# EasyEDA Pro project ProPrj_MSP3507拓展板_2025-07-14_10-12-05_2025-07-20.epro, board PCB1
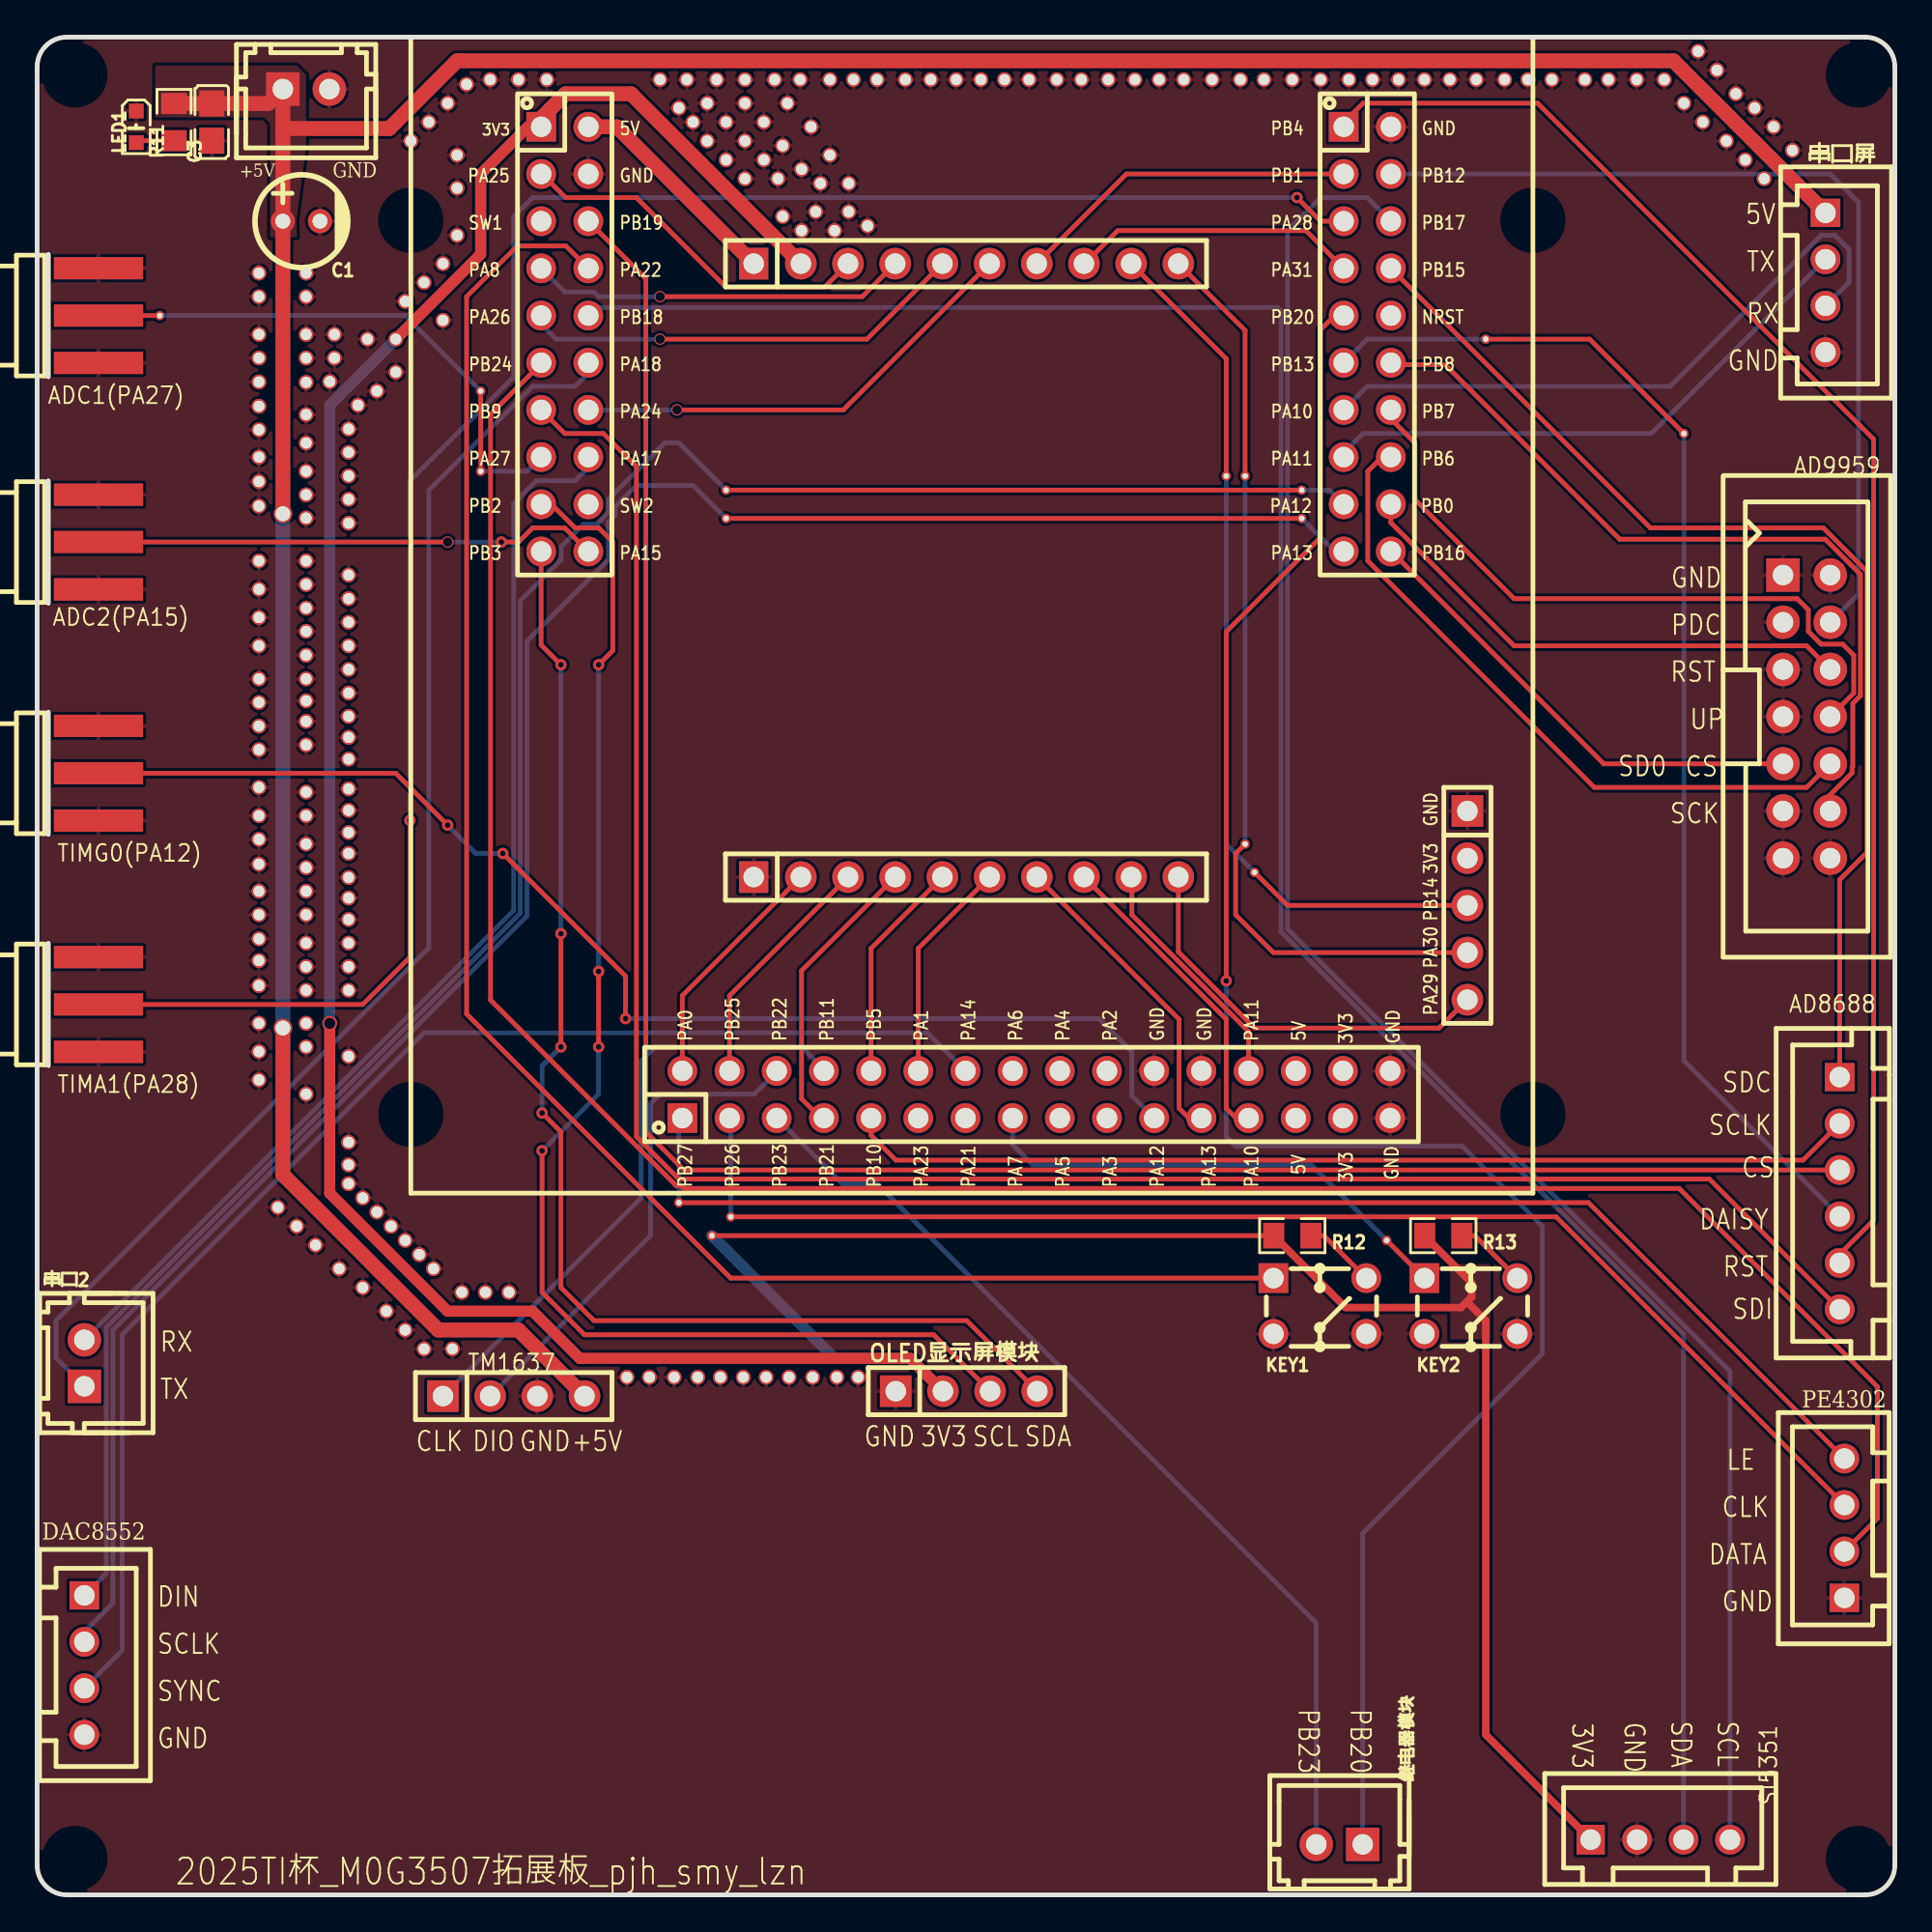
[diagram p1: board, top side]
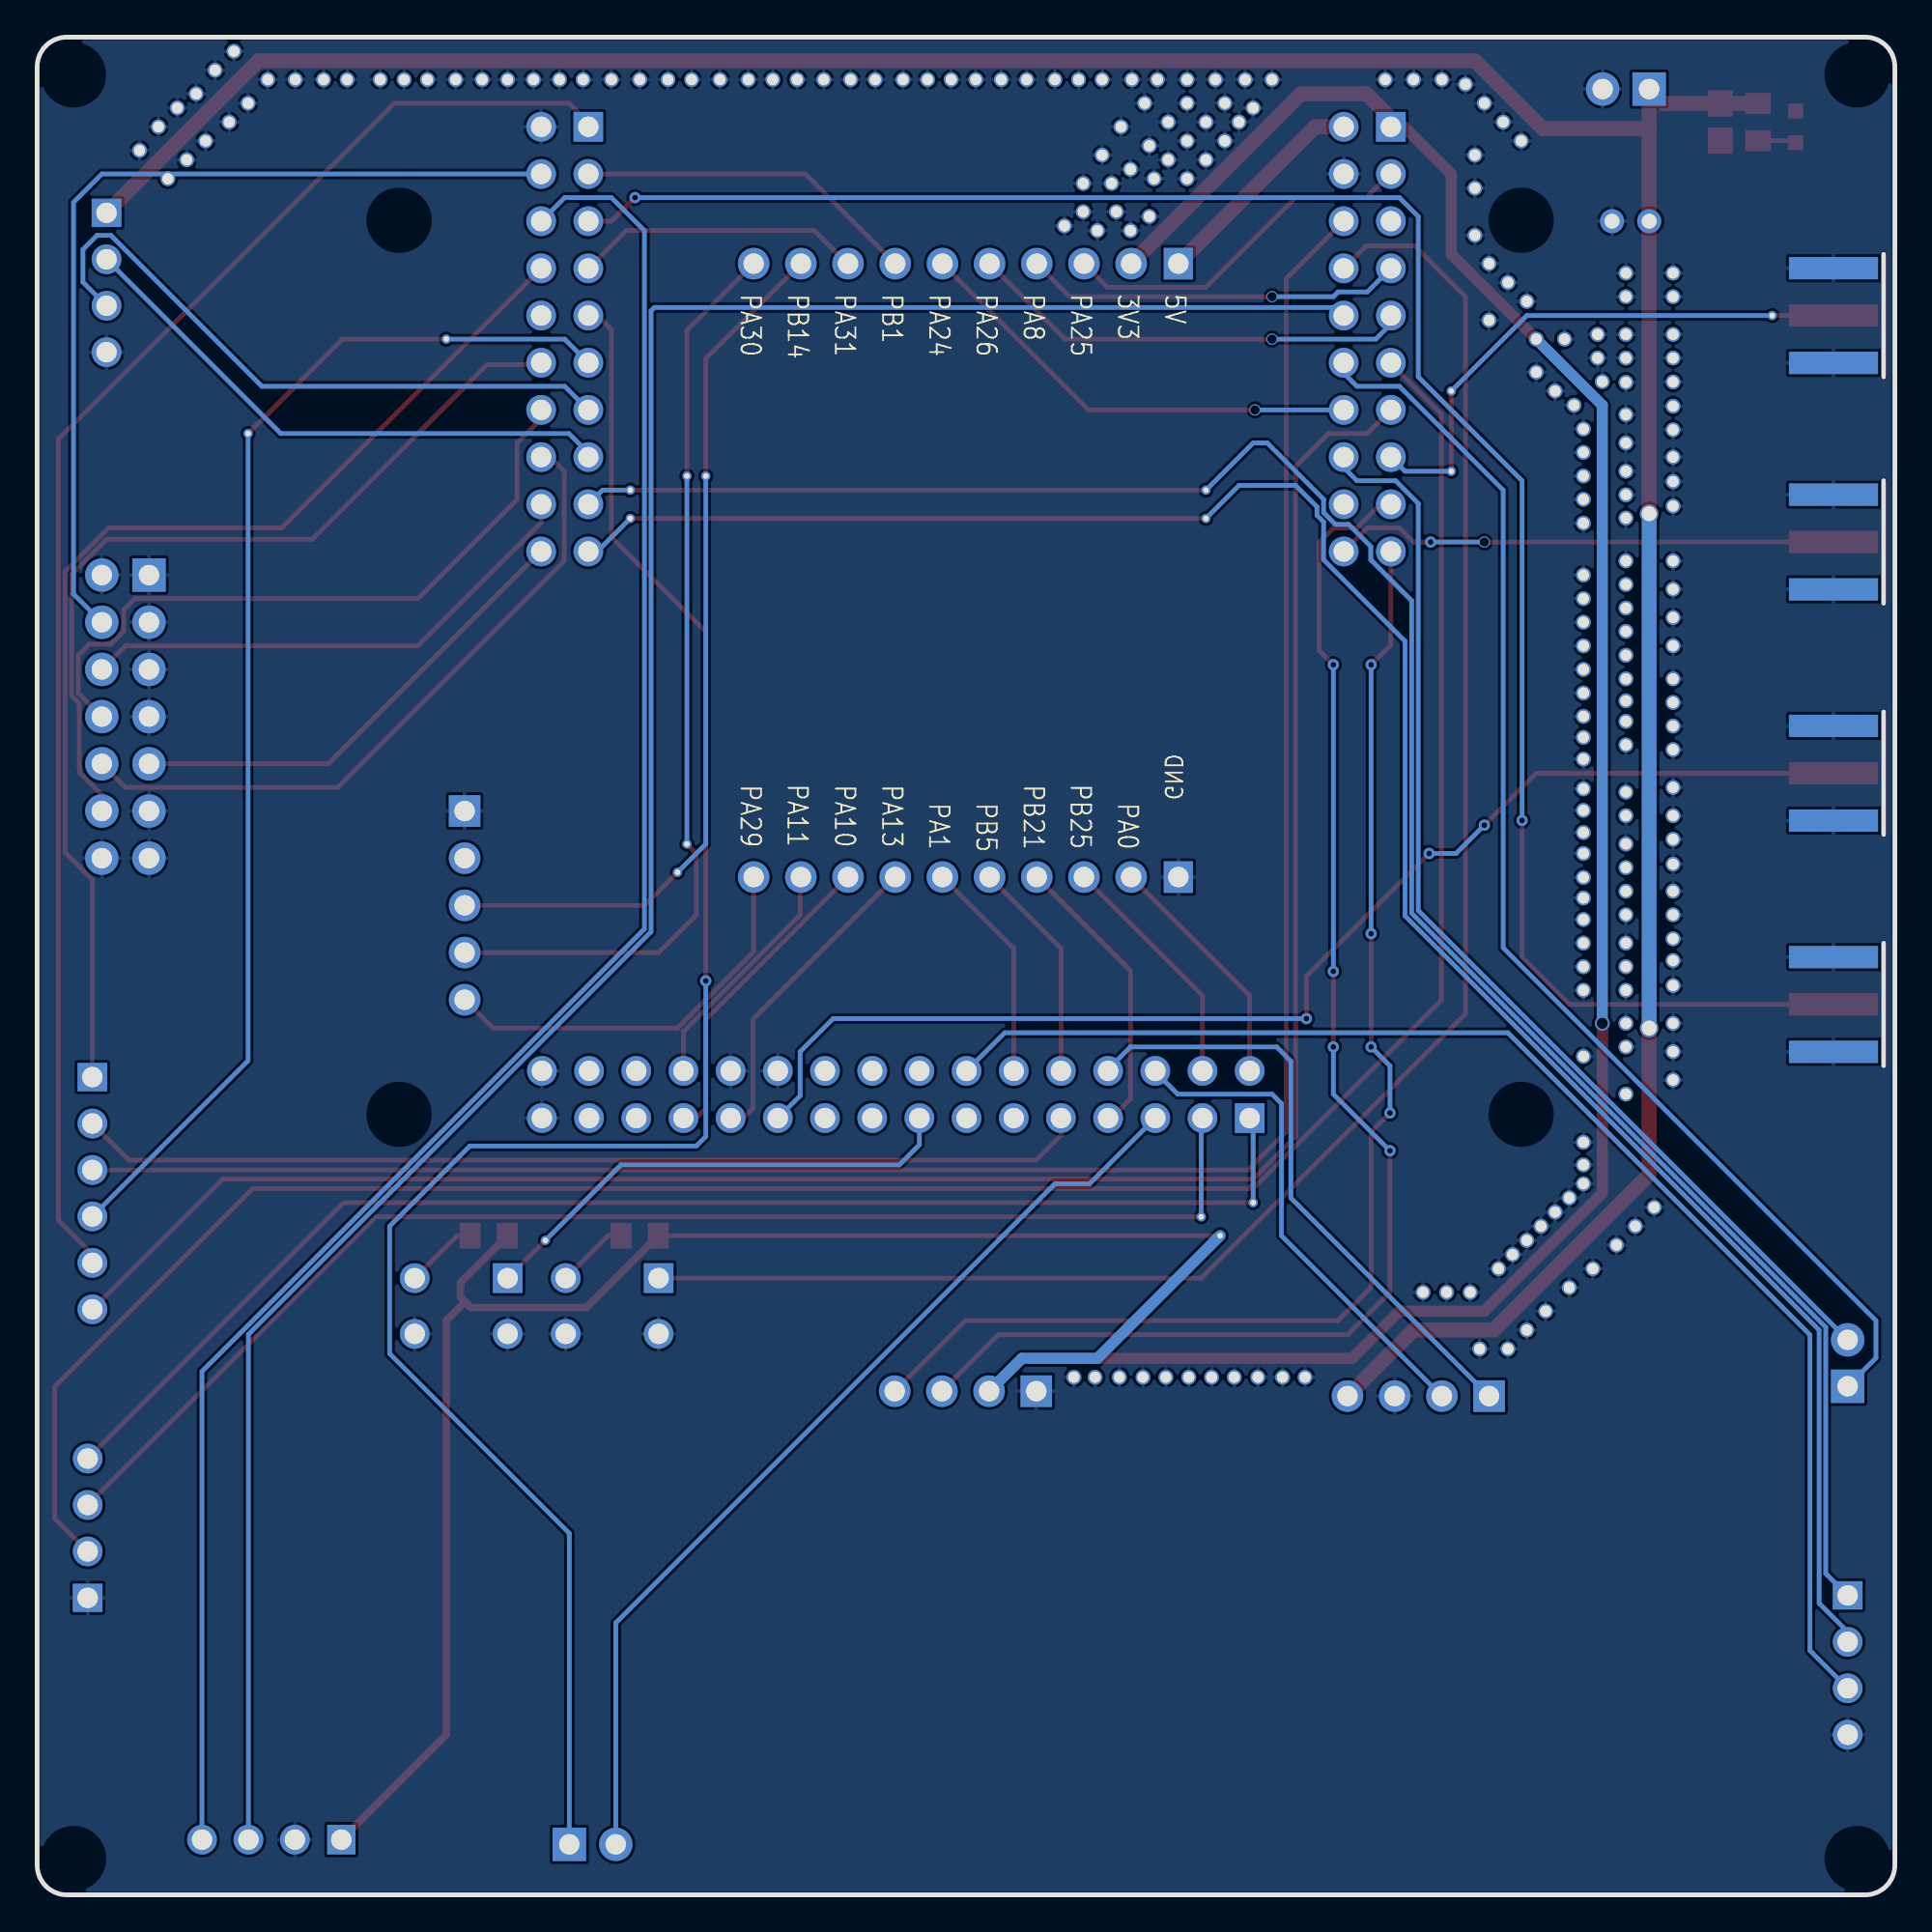
[diagram p2: board, bottom side, seen from below]

Outline 100 x 100 mm; copper layers: Top Layer, Bottom Layer. Coordinates in mm from the lower left corner of the outline.
Outline path: 0,98.4 0,1.6 arc(0.47,0.47) 1.6,0 98.4,0 arc(99.53,0.47) 100,1.6 100,98.4 arc(99.53,99.53) 98.4,100 1.6,100 arc(0.47,99.53) 0,98.4
Stack: Top Layer 0.035mm / Dielectric1 1.51mm FR4 er 4.5 / Bottom Layer 0.035mm

## Design rules (mm)
template: JLCPCB Capability(Two Layers Board)
spacing copperThickness1oz (default): track to track 0.102, other pairs 0.152 to 0.3
spacing copperThickness2oz: track to track 0.203, other pairs 0.152 to 0.3
track width copperThickness1oz (default): min 0.127, default 0.254, max 2.54
track width copperThickness2oz: min 0.203, default 0.254, max 2.54
differential pair differentialPair (default): width min 0.127, default 0.254, max 2.54; gap min 0.152, default 0.152
via viaSize (default): diameter min 0.5, default 0.61, max 10; hole min 0.3, default 0.305, max 6.3

## Placement (name value [footprint] x y rotation side)
3V3  -  [2*10Pin排针]  27.13 95.17 0 top
+5V  ZX-XH2.54-2PZZ  [CONN-TH_2P-P2.50_HX25003-2A]  14.48 97.21 0 top
AD8688  ZX-XH2.54-6PZZ  [CONN-TH_6P-P2.50_ZX-XH2.54-6PZZ]  97.03 37.77 90 top
AD9959  2.54-2*7P简牛  [IDC-TH_14P-P2.54-V-R2-C7-S2.54]  95.25 63.42 270 top
ADC1(PA27)  BWSMA-KE-P001  [SMA-SMD_BWSMA-KE-P001]  3.3 85.01 180 top
ADC2(PA15)  BWSMA-KE-P001  [SMA-SMD_BWSMA-KE-P001]  3.3 72.82 180 top
C1  47uF  [CAP-TH_BD5.0-P2.00-D0.8-FD]  14.22 90.09 0 top
C3  47nF  [C0805]  9.4 95.43 90 top
DAC8552  ZX-XH2.54-4PZZ  [CONN-TH_4P-P2.50_4PIN]  2.54 12.37 270 top
GND  PM254-1-10-Z-8.5  [HDR-TH_10P-P2.54-V-F]  50 54.79 0 top
KEY1  -  [4角直插式开关]  66.55 33.2 0 top
KEY2  -  [4角直插式开关]  74.68 33.2 0 top
LED1  SZYY0603R  [LED0603-R-RD]  5.33 95.17 270 top
NOREF  -  [Pad_e1186]  86.11 97.71 0 top
NOREF#2  -  [Pad_e1173]  67.56 97.71 0 top
NOREF#3  -  [Pad_e1153]  39.7 97.71 0 top
NOREF#4  -  [Pad_e1044]  18.8 31.42 0 top
NOREF#5  -  [Pad_e1144]  22.1 96.44 0 top
NOREF#6  -  [Pad_e1133]  14.48 54.03 0 top
NOREF#7  -  [Pad_e1198]  94.49 93.9 0 top
NOREF#8  -  [Pad_e1065]  19.05 35.99 0 top
NOREF#9  -  [Pad_e1170]  63.25 97.71 0 top
NOREF#10  -  [Pad_e1024]  11.94 64.19 0 top
NOREF#11  -  [Pad_e1019]  11.94 71.81 0 top
NOREF#12  -  [Pad_e1088]  16.76 68.5 0 top
NOREF#13  -  [Pad_e1027]  11.94 59.61 0 top
NOREF#14  -  [Pad_e1070]  16.76 40.51 0 top
NOREF#15  -  [Pad_e842]  65.02 76.38 0 top
NOREF#16  -  [Pad_e1191]  91.95 93.4 0 top
NOREF#17  -  [Pad_e1134]  14.48 52.76 0 top
NOREF#18  -  [Pad_e1181]  78.99 97.71 0 top
NOREF#19  -  [Pad_e1022]  11.94 67.23 0 top
NOREF#20  -  [Pad_e1103]  21.84 87.81 0 top
NOREF#21  -  [Pad_e1076]  16.76 53.66 0 top
NOREF#22  -  [Pad_e1148]  27.43 97.71 0 top
NOREF#23  -  [Pad_e1042]  16.26 33.71 0 top
NOREF#24  -  [Pad_e1171]  64.77 97.71 0 top
NOREF#25  -  [Pad_e1125]  14.48 65.46 0 top
NOREF#26  -  [Pad_e1061]  25.4 32.44 0 top
NOREF#27  -  [Pad_e1208]  38.1 94.41 0 top
NOREF#28  -  [Pad_e1168]  60.4 97.71 0 top
NOREF#29  -  [Pad_e1038]  11.94 43.87 0 top
NOREF#30  -  [Pad_e1136]  14.48 49.96 0 top
NOREF#31  -  [Pad_e1119]  14.48 74.11 0 top
NOREF#32  -  [Pad_e1043]  17.53 32.69 0 top
NOREF#33  -  [Pad_e1107]  14.48 86.03 0 top
NOREF#34  -  [Pad_e1117]  14.48 76.63 0 top
NOREF#35  -  [Pad_e1030]  11.94 55.48 0 top
NOREF#36  -  [Pad_e1095]  16.76 78.91 0 top
NOREF#37  -  [Pad_e1166]  57.66 97.71 0 top
NOREF#38  -  [Pad_e1047]  22.35 29.39 0 top
NOREF#39  -  [Pad_e1105]  19.81 85.78 0 top
NOREF#40  -  [Pad_e742]  19.3 83.74 0 top
NOREF#41  -  [Pad_e1197]  93.47 95.17 0 top
NOREF#42  -  [Pad_e1008]  11.94 87.3 0 top
NOREF#43  -  [Pad_e1131]  14.48 56.57 0 top
NOREF#44  -  [Pad_e1206]  36.07 96.44 0 top
NOREF#45  -  [Pad_e1121]  14.48 70.54 0 top
NOREF#46  -  [Pad_e1089]  16.76 69.77 0 top
NOREF#47  -  [Pad_e1066]  19.81 35.23 0 top
NOREF#48  -  [Pad_e595]  37.08 75.62 0 top
NOREF#49  -  [Pad_e1187]  87.59 97.71 0 top
NOREF#50  -  [Pad_e547]  37.34 36.5 0 top
NOREF#51  -  [Pad_e1016]  11.94 77.39 0 top
NOREF#52  -  [Pad_e1120]  14.48 71.81 0 top
NOREF#53  -  [Pad_e1169]  61.72 97.71 0 top
NOREF#54  -  [Pad_e1193]  89.41 99.24 0 top
NOREF#55  -  [Pad_e1137]  14.48 48.69 0 top
NOREF#56  -  [Pad_e1049]  32.96 27.86 0 top
NOREF#57  -  [Pad_e555]  72.64 35.23 0 top
NOREF#58  -  [Pad_e596]  37.08 74.09 0 top
NOREF#59  -  [Pad_e1069]  16.76 39.29 0 top
NOREF#60  -  [Pad_e1127]  14.48 63.17 0 top
NOREF#61  -  [Pad_e1179]  76.04 97.71 0 top
NOREF#62  -  [Pad_e1180]  77.47 97.71 0 top
NOREF#63  -  [Pad_e1200]  35.31 95.43 0 top
NOREF#64  -  [Pad_e1102]  22.61 89.33 0 top
NOREF#65  -  [Pad_e1190]  90.93 94.41 0 top
NOREF#66  -  [Pad_e1054]  39.24 27.86 0 top
NOREF#67  -  [Pad_e1078]  16.76 56.06 0 top
NOREF#68  -  [Pad_e1140]  14.48 43.1 0 top
NOREF#69  -  [Pad_e1138]  14.48 46.91 0 top
NOREF#70  -  [Pad_e1123]  14.48 68.01 0 top
NOREF#71  -  [Pad_e1071]  16.76 45.14 0 top
NOREF#72  -  [Pad_e1064]  18.29 36.75 0 top
NOREF#73  -  [Pad_e1031]  11.94 54.03 0 top
NOREF#74  -  [Pad_e1207]  37.08 95.43 0 top
NOREF#75  -  [Pad_e1057]  43.05 27.86 0 top
NOREF#76  -  [Pad_e1147]  25.91 97.71 0 top
NOREF#77  -  [Pad_e1126]  14.48 64.27 0 top
NOREF#78  -  [Pad_e1194]  90.42 98.22 0 top
NOREF#79  -  [Pad_e608]  68.07 74.09 0 top
NOREF#80  -  [Pad_e1152]  38.1 97.71 0 top
NOREF#81  -  [Pad_e1068]  21.34 33.71 0 top
NOREF#82  -  [Pad_e1145]  23.11 97.46 0 top
NOREF#83  -  [Pad_e1109]  14.48 84 0 top
NOREF#84  -  [Pad_e1011]  11.94 84 0 top
NOREF#85  -  [Pad_e1209]  39.12 93.4 0 top
NOREF#86  -  [Pad_e1156]  43.94 97.71 0 top
NOREF#87  -  [Pad_e1046]  20.83 29.39 0 top
NOREF#88  -  [Pad_e1012]  11.94 82.73 0 top
NOREF#89  -  [Pad_e1182]  80.25 97.71 0 top
NOREF#90  -  [Pad_e765]  88.65 78.66 0 top
NOREF#91  -  [Pad_e1104]  20.83 86.79 0 top
NOREF#92  -  [Pad_e607]  68.07 75.62 0 top
NOREF#93  -  [Pad_e1218]  43.69 90.6 0 top
NOREF#94  -  [Pad_e1017]  11.94 76.08 0 top
NOREF#95  -  [Pad_e1110]  14.48 82.73 0 top
NOREF#96  -  [Pad_e1101]  22.61 91.87 0 top
NOREF#97  -  [Pad_e1059]  22.86 32.44 0 top
NOREF#98  -  [Pad_e1040]  13.97 35.99 0 top
NOREF#99  -  [Pad_e625]  23.88 76.63 0 top
NOREF#100  -  [Pad_e1090]  16.76 71.04 0 top
NOREF#101  -  [Pad_e1130]  14.48 58.09 0 top
NOREF#102  -  [Pad_e1077]  16.76 54.76 0 top
NOREF#103  -  [Pad_e1026]  11.94 61.65 0 top
NOREF#104  -  [Pad_e1073]  16.76 49.96 0 top
NOREF#105  -  [Pad_e1223]  42.67 93.65 0 top
NOREF#106  -  [Pad_e1178]  74.68 97.71 0 top
NOREF#107  -  [Pad_e755]  13.23 74.35 0 top
NOREF#108  -  [Pad_e1116]  14.48 78.16 0 top
NOREF#109  -  [Pad_e1204]  40.13 90.35 0 top
NOREF#110  -  [Pad_e1216]  41.15 92.89 0 top
NOREF#111  -  [Pad_e1079]  16.76 57.18 0 top
NOREF#112  -  [Pad_e1067]  20.57 34.47 0 top
NOREF#113  -  [Pad_e1041]  14.99 34.98 0 top
NOREF#114  -  [Pad_e1212]  42.93 89.59 0 top
NOREF#115  -  [Pad_e1174]  69.09 97.71 0 top
NOREF#116  -  [Pad_e1015]  11.94 78.86 0 top
NOREF#117  -  [Pad_e1051]  35.56 27.86 0 top
NOREF#118  -  [Pad_e1106]  14.48 87.3 0 top
NOREF#119  -  [Pad_e1129]  14.48 59.36 0 top
NOREF#120  -  [Pad_e1118]  14.48 75.36 0 top
NOREF#121  -  [Pad_e1222]  41.66 95.17 0 top
NOREF#122  -  [Pad_e1162]  52.07 97.71 0 top
NOREF#123  -  [Pad_e1211]  41.91 90.6 0 top
NOREF#124  -  [Pad_e1124]  14.48 66.73 0 top
NOREF#125  -  [Pad_e1100]  22.61 93.65 0 top
NOREF#126  -  [Pad_e1039]  12.95 37.01 0 top
NOREF#127  -  [Pad_e1221]  40.39 96.44 0 top
NOREF#128  -  [Pad_e1063]  17.53 37.52 0 top
NOREF#129  -  [Pad_e1114]  15.75 81.46 0 top
NOREF#130  -  [Pad_e1098]  19.3 81.97 0 top
NOREF#131  -  [Pad_e1082]  16.76 61.14 0 top
NOREF#132  -  [Pad_e1160]  49.47 97.71 0 top
NOREF#133  -  [Pad_e1033]  11.94 51.46 0 top
NOREF#134  -  [Pad_e1010]  11.94 86.03 0 top
NOREF#135  -  [Pad_e1050]  34.29 27.86 0 top
NOREF#136  -  [Pad_e1058]  44.19 27.86 0 top
NOREF#137  -  [Pad_e1217]  42.16 92.13 0 top
NOREF#138  -  [Pad_e1203]  38.1 92.38 0 top
NOREF#139  -  [Pad_e1023]  11.94 65.46 0 top
NOREF#140  -  [Pad_e1093]  16.76 76.38 0 top
NOREF#141  -  [Pad_e841]  64.01 76.38 0 top
NOREF#142  -  [Pad_e1056]  41.74 27.86 0 top
NOREF#143  -  [Pad_e1132]  14.48 55.3 0 top
NOREF#144  -  [Pad_e1128]  14.48 61.9 0 top
NOREF#145  -  [Pad_e1177]  73.28 97.71 0 top
NOREF#146  -  [Pad_e1025]  11.94 62.92 0 top
NOREF#147  -  [Pad_e1081]  16.76 59.54 0 top
NOREF#148  -  [Pad_e1021]  11.94 68.76 0 top
NOREF#149  -  [Pad_e1091]  16.76 73.84 0 top
NOREF#150  -  [Pad_e1135]  14.48 51.23 0 top
NOREF#151  -  [Pad_e1020]  11.94 70.28 0 top
NOREF#152  -  [Pad_e1083]  16.76 62.31 0 top
NOREF#153  -  [Pad_e1122]  14.48 69.27 0 top
NOREF#154  -  [Pad_e1164]  54.89 97.71 0 top
NOREF#155  -  [Pad_e1202]  37.08 93.4 0 top
NOREF#156  -  [Pad_e1086]  16.76 65.96 0 top
NOREF#157  -  [Pad_e1113]  16 82.73 0 top
NOREF#158  -  [Pad_e1184]  83.31 97.71 0 top
NOREF#159  -  [Pad_e731]  36.32 35.48 0 top
NOREF#160  -  [Pad_e1157]  45.21 97.71 0 top
NOREF#161  -  [Pad_e1159]  48.1 97.71 0 top
NOREF#162  -  [Pad_e758]  13.23 46.66 0 top
NOREF#163  -  [Pad_e1014]  11.94 80.13 0 top
NOREF#164  -  [Pad_e1219]  44.7 89.84 0 top
NOREF#165  -  [Pad_e1167]  59.09 97.71 0 top
NOREF#166  -  [Pad_e1035]  11.94 48.95 0 top
NOREF#167  -  [Pad_e1048]  31.75 27.86 0 top
NOREF#168  -  [Pad_e1165]  56.21 97.71 0 top
NOREF#169  -  [Pad_e1210]  39.88 92.38 0 top
NOREF#170  -  [Pad_e1052]  36.78 27.86 0 top
NOREF#171  -  [Pad_e1013]  11.94 81.44 0 top
NOREF#172  -  [Pad_e1158]  46.74 97.71 0 top
NOREF#173  -  [Pad_e1143]  21.08 95.43 0 top
NOREF#174  -  [Pad_e1062]  16.76 38.28 0 top
NOREF#175  -  [Pad_e1087]  16.76 67.23 0 top
NOREF#176  -  [Pad_e1111]  14.48 81.42 0 top
NOREF#177  -  [Pad_e1055]  40.47 27.86 0 top
NOREF#178  -  [Pad_e1146]  24.38 97.71 0 top
NOREF#179  -  [Pad_e1108]  17.78 83.74 0 top
NOREF#180  -  [Pad_e1032]  11.94 52.76 0 top
NOREF#181  -  [Pad_e1150]  34.97 97.71 0 top
NOREF#182  -  [Pad_e1142]  20.11 94.41 0 top
NOREF#183  -  [Pad_e1192]  92.96 92.38 0 top
NOREF#184  -  [Pad_e1112]  16 84 0 top
NOREF#185  -  [Pad_e626]  23.88 80.95 0 top
NOREF#186  -  [Pad_e1205]  41.15 89.59 0 top
NOREF#187  -  [Pad_e1163]  53.39 97.71 0 top
NOREF#188  -  [Pad_e1220]  43.69 92.13 0 top
NOREF#189  -  [Pad_e1075]  16.76 52.5 0 top
NOREF#190  -  [Pad_e1149]  33.53 97.71 0 top
NOREF#191  -  [Pad_e1099]  21.84 84.76 0 top
NOREF#192  -  [Pad_e768]  77.98 83.74 0 top
NOREF#193  -  [Pad_e1189]  89.66 95.43 0 top
NOREF#194  -  [Pad_e1151]  36.58 97.71 0 top
NOREF#195  -  [Pad_e1172]  66.04 97.71 0 top
NOREF#196  -  [Pad_e1188]  88.65 96.44 0 top
NOREF#197  -  [Pad_e1139]  14.48 45.64 0 top
NOREF#198  -  [Pad_e860]  65.02 56.57 0 top
NOREF#199  -  [Pad_e1034]  11.94 50.29 0 top
NOREF#200  -  [Pad_e1029]  11.94 56.82 0 top
NOREF#201  -  [Pad_e1037]  11.94 45.39 0 top
NOREF#202  -  [Pad_e1214]  39.12 95.43 0 top
NOREF#203  -  [Pad_e1085]  16.76 64.69 0 top
NOREF#204  -  [Pad_e1161]  50.8 97.71 0 top
NOREF#205  -  [Pad_e1018]  11.94 74.76 0 top
NOREF#206  -  [Pad_e1036]  11.94 46.91 0 top
NOREF#207  -  [Pad_e1084]  16.76 63.44 0 top
NOREF#208  -  [Pad_e1176]  71.88 97.71 0 top
NOREF#209  -  [Pad_e1060]  24.13 32.44 0 top
NOREF#210  -  [Pad_e1028]  11.94 58.09 0 top
NOREF#211  -  [Pad_e1213]  38.1 96.44 0 top
NOREF#212  -  [Pad_e1045]  19.81 30.4 0 top
NOREF#213  -  [Pad_e1094]  16.76 77.65 0 top
NOREF#214  -  [Pad_e1195]  91.44 96.95 0 top
NOREF#215  -  [Pad_e1199]  34.54 96.19 0 top
NOREF#216  -  [Pad_e1092]  16.76 75.12 0 top
NOREF#217  -  [Pad_e1185]  84.58 97.71 0 top
NOREF#218  -  [Pad_e1074]  16.76 51.23 0 top
NOREF#219  -  [Pad_e1196]  92.46 96.19 0 top
NOREF#220  -  [Pad_e1183]  81.53 97.71 0 top
NOREF#221  -  [Pad_e1154]  41.07 97.71 0 top
NOREF#222  -  [Pad_e545]  34.54 37.26 0 top
NOREF#223  -  [Pad_e1175]  70.61 97.71 0 top
NOREF#224  -  [Pad_e1155]  42.67 97.71 0 top
NOREF#225  -  [Pad_e1097]  18.29 80.95 0 top
NOREF#226  -  [Pad_e633]  6.6 85.01 0 top
NOREF#227  -  [Pad_e1080]  16.76 58.38 0 top
NOREF#228  -  [Pad_e1096]  17.27 80.19 0 top
NOREF#229  -  [Pad_e1072]  16.76 48.69 0 top
NOREF#230  -  [Pad_e1053]  38.01 27.86 0 top
NOREF#231  -  [Pad_e1201]  36.07 94.41 0 top
NOREF#232  -  [Pad_e1115]  14.48 79.68 0 top
NOREF#233  -  [Pad_e1215]  40.13 94.16 0 top
NOREF#234  -  [Pad_e861]  65.53 55.04 0 top
OLED显示屏模块  -  [HDR-TH_4P-P2.54-V-F]  50.03 27.11 0 top
PE4302  ZX-XH2.54-4PZZ  [CONN-TH_4P-P2.50_4PIN]  97.28 19.74 90 top
R11  4.7kΩ  [R0805]  7.37 95.43 270 top
R12  1kΩ  [R0805]  67.56 35.48 180 top
R13  1kΩ  [R0805]  75.69 35.48 180 top
SI5351  ZX-XH2.54-4PZZ  [CONN-TH_4P-P2.50_4PIN]  87.38 2.97 0 top
TIMA1(PA28)  BWSMA-KE-P001  [SMA-SMD_BWSMA-KE-P001]  3.3 47.93 180 top
TIMG0(PA12)  BWSMA-KE-P001  [SMA-SMD_BWSMA-KE-P001]  3.3 60.38 180 top
TM1637  -  [HDR-TH_4P-P2.54-V-F]  25.65 26.85 0 top
U2  -  [2*10Pin排针]  70.33 95.17 0 top
U3  -  [2*16Pin排针]  34.73 41.81 90 top
U4  PZ254V-11-05P  [HDR-TH_5P-P2.54-V-M]  76.99 53.26 270 top
U5  PM254-1-10-Z-8.5  [HDR-TH_10P-P2.54-V-F]  50 87.81 0 top
串口2  ZX-XH2.54-2PZZ  [CONN-TH_2P-P2.50_HX25003-2A]  2.54 28.63 90 top
串口屏  ZX-XH2.54-4PZZ  [CONN-TH_4P-P2.50_4PIN]  96.27 86.79 270 top
继电器模块  ZX-XH2.54-2PZZ  [CONN-TH_2P-P2.50_HX25003-2A]  70.1 2.72 180 top

## Footprints (pads in the part's own frame, mm; a bottom-side part is the same pattern mirrored in y, then rotated)
2*10Pin排针
  rect 1.6x1.6 hole 1.1: 1(0,0)
  round 1.6 hole 1.1: 2(0,-2.54) 3(0,-5.08) 4(0,-7.62) 5(0,-10.16) 6(0,-12.7) 7(0,-15.24) 8(0,-17.78) 9(0,-20.32) 10(0,-22.86) 11(2.54,-22.86) 12(2.54,-20.32) 13(2.54,-17.78) 14(2.54,-15.24) 15(2.54,-12.7) 16(2.54,-10.16) 17(2.54,-7.62) 18(2.54,-5.08) 19(2.54,-2.54) 20(2.54,0)
2*16Pin排针
  rect 1.6x1.6 hole 1.1: 1(0,0)
  round 1.6 hole 1.1: 2(0,-2.54) 3(0,-5.08) 4(0,-7.62) 5(0,-10.16) 6(0,-12.7) 7(0,-15.24) 8(0,-17.78) 9(0,-20.32) 10(0,-22.86) 11(0,-25.4) 12(0,-27.94) 13(0,-30.48) 14(0,-33.02) 15(0,-35.56) 16(0,-38.1) 17(2.54,-38.1) 18(2.54,-35.56) 19(2.54,-33.02) 20(2.54,-30.48) 21(2.54,-27.94) 22(2.54,-25.4) 23(2.54,-22.86) 24(2.54,-20.32) 25(2.54,-17.78) 26(2.54,-15.24) 27(2.54,-12.7) 28(2.54,-10.16) 29(2.54,-7.62) 30(2.54,-5.08) 31(2.54,-2.54) 32(2.54,0)
4角直插式开关
  rect 1.6x1.6 hole 1.1: 1(0,0)
  round 1.6 hole 1.1: 2(0,-3) 3(5,0) 4(5,-3)
C0805
  rect 1.41x1.35 smd: 1(-1,0) 2(1,0)
CAP-TH_BD5.0-P2.00-D0.8-FD
  round 1.3 hole 0.8: 1(-1,0) 2(1,0)
CONN-TH_2P-P2.50_HX25003-2A
  rect 1.8x1.8 hole 1.1: 1(-1.25,0)
  round 1.8 hole 1.1: 2(1.25,0)
CONN-TH_4P-P2.50_4PIN
  rect 1.524x1.6 hole 1.1: 1(-3.75,0)
  round 1.6 hole 1.1: 2(-1.25,0) 3(1.25,0) 4(3.75,0)
CONN-TH_6P-P2.50_ZX-XH2.54-6PZZ
  rect 1.524x1.6 hole 1.1: 1(6.25,0)
  round 1.6 hole 1.1: 2(3.75,0) 3(1.25,0) 4(-1.25,0) 5(-3.75,0) 6(-6.25,0)
HDR-TH_4P-P2.54-V-F
  rect 1.7x1.7 hole 1.1: 1(-3.81,0)
  round 1.7 hole 1.1: 2(-1.27,0) 3(1.27,0) 4(3.81,0)
HDR-TH_5P-P2.54-V-M
  rect 1.7x1.7 hole 1.1: 1(-5.08,0)
  round 1.7 hole 1.1: 2(-2.54,0) 3(0,0) 4(2.54,0) 5(5.08,0)
HDR-TH_10P-P2.54-V-F
  rect 1.575x1.7 hole 1.1: 1(-11.43,0)
  round 1.7 hole 1.1: 2(-8.89,0) 3(-6.35,0) 4(-3.81,0) 5(-1.27,0) 6(1.27,0) 7(3.81,0) 8(6.35,0) 9(8.89,0) 10(11.43,0)
IDC-TH_14P-P2.54-V-R2-C7-S2.54
  rect 1.8x1.8 hole 1.1: 1(-7.62,-1.27)
  round 1.8 hole 1.1: 2(-7.62,1.27) 3(-5.08,-1.27) 4(-5.08,1.27) 5(-2.54,-1.27) 6(-2.54,1.27) 7(0,-1.27) 8(0,1.27) 9(2.54,-1.27) 10(2.54,1.27) 11(5.08,-1.27) 12(5.08,1.27) 13(7.62,-1.27) 14(7.62,1.27)
LED0603-R-RD
  rect 0.8x0.8 smd: 1(0.851,0) 2(-0.851,0)
Pad_e545
  round 0.5 hole 0.3: 1(0,0)
Pad_e547
  round 0.5 hole 0.3: 1(0,0)
Pad_e555
  round 0.5 hole 0.3: 1(0,0)
Pad_e595
  round 0.5 hole 0.3: 1(0,0)
Pad_e596
  round 0.5 hole 0.3: 1(0,0)
Pad_e607
  round 0.5 hole 0.3: 1(0,0)
Pad_e608
  round 0.5 hole 0.3: 1(0,0)
Pad_e625
  round 0.5 hole 0.3: 1(0,0)
Pad_e626
  round 0.5 hole 0.3: 2(0,0)
Pad_e633
  round 0.5 hole 0.3: 1(0,0)
Pad_e731
  round 0.5 hole 0.3: 1(0,0)
Pad_e742
  round 0.8 hole 0.6: 2(0,0)
Pad_e755
  round 1 hole 0.8: 2(0,0)
Pad_e758
  round 1 hole 0.8: 2(0,0)
Pad_e765
  round 0.5 hole 0.3: 1(0,0)
Pad_e768
  round 0.5 hole 0.3: 1(0,0)
Pad_e841
  round 0.5 hole 0.3: 1(0,0)
Pad_e842
  round 0.5 hole 0.3: 1(0,0)
Pad_e860
  round 0.5 hole 0.3: 1(0,0)
Pad_e861
  round 0.5 hole 0.3: 1(0,0)
Pad_e1008
  round 0.8 hole 0.6: 1(0,0)
Pad_e1010
  round 0.8 hole 0.6: 1(0,0)
Pad_e1011
  round 0.8 hole 0.6: 1(0,0)
Pad_e1012
  round 0.8 hole 0.6: 1(0,0)
Pad_e1013
  round 0.8 hole 0.6: 1(0,0)
Pad_e1014
  round 0.8 hole 0.6: 1(0,0)
Pad_e1015
  round 0.8 hole 0.6: 1(0,0)
Pad_e1016
  round 0.8 hole 0.6: 1(0,0)
Pad_e1017
  round 0.8 hole 0.6: 1(0,0)
Pad_e1018
  round 0.8 hole 0.6: 1(0,0)
Pad_e1019
  round 0.8 hole 0.6: 1(0,0)
Pad_e1020
  round 0.8 hole 0.6: 1(0,0)
Pad_e1021
  round 0.8 hole 0.6: 1(0,0)
Pad_e1022
  round 0.8 hole 0.6: 1(0,0)
Pad_e1023
  round 0.8 hole 0.6: 1(0,0)
Pad_e1024
  round 0.8 hole 0.6: 1(0,0)
Pad_e1025
  round 0.8 hole 0.6: 1(0,0)
Pad_e1026
  round 0.8 hole 0.6: 1(0,0)
Pad_e1027
  round 0.8 hole 0.6: 1(0,0)
Pad_e1028
  round 0.8 hole 0.6: 1(0,0)
Pad_e1029
  round 0.8 hole 0.6: 1(0,0)
Pad_e1030
  round 0.8 hole 0.6: 1(0,0)
Pad_e1031
  round 0.8 hole 0.6: 1(0,0)
Pad_e1032
  round 0.8 hole 0.6: 1(0,0)
Pad_e1033
  round 0.8 hole 0.6: 1(0,0)
Pad_e1034
  round 0.8 hole 0.6: 1(0,0)
Pad_e1035
  round 0.8 hole 0.6: 1(0,0)
Pad_e1036
  round 0.8 hole 0.6: 1(0,0)
Pad_e1037
  round 0.8 hole 0.6: 1(0,0)
Pad_e1038
  round 0.8 hole 0.6: 1(0,0)
Pad_e1039
  round 0.8 hole 0.6: 1(0,0)
Pad_e1040
  round 0.8 hole 0.6: 1(0,0)
Pad_e1041
  round 0.8 hole 0.6: 1(0,0)
Pad_e1042
  round 0.8 hole 0.6: 1(0,0)
Pad_e1043
  round 0.8 hole 0.6: 1(0,0)
Pad_e1044
  round 0.8 hole 0.6: 1(0,0)
Pad_e1045
  round 0.8 hole 0.6: 1(0,0)
Pad_e1046
  round 0.8 hole 0.6: 1(0,0)
Pad_e1047
  round 0.8 hole 0.6: 1(0,0)
Pad_e1048
  round 0.8 hole 0.6: 1(0,0)
Pad_e1049
  round 0.8 hole 0.6: 1(0,0)
Pad_e1050
  round 0.8 hole 0.6: 1(0,0)
Pad_e1051
  round 0.8 hole 0.6: 1(0,0)
Pad_e1052
  round 0.8 hole 0.6: 1(0,0)
Pad_e1053
  round 0.8 hole 0.6: 1(0,0)
Pad_e1054
  round 0.8 hole 0.6: 1(0,0)
Pad_e1055
  round 0.8 hole 0.6: 1(0,0)
Pad_e1056
  round 0.8 hole 0.6: 1(0,0)
Pad_e1057
  round 0.8 hole 0.6: 1(0,0)
Pad_e1058
  round 0.8 hole 0.6: 1(0,0)
Pad_e1059
  round 0.8 hole 0.6: 1(0,0)
Pad_e1060
  round 0.8 hole 0.6: 1(0,0)
Pad_e1061
  round 0.8 hole 0.6: 1(0,0)
Pad_e1062
  round 0.8 hole 0.6: 1(0,0)
Pad_e1063
  round 0.8 hole 0.6: 1(0,0)
Pad_e1064
  round 0.8 hole 0.6: 1(0,0)
Pad_e1065
  round 0.8 hole 0.6: 1(0,0)
Pad_e1066
  round 0.8 hole 0.6: 1(0,0)
Pad_e1067
  round 0.8 hole 0.6: 1(0,0)
Pad_e1068
  round 0.8 hole 0.6: 1(0,0)
Pad_e1069
  round 0.8 hole 0.6: 1(0,0)
Pad_e1070
  round 0.8 hole 0.6: 1(0,0)
Pad_e1071
  round 0.8 hole 0.6: 1(0,0)
Pad_e1072
  round 0.8 hole 0.6: 1(0,0)
Pad_e1073
  round 0.8 hole 0.6: 1(0,0)
Pad_e1074
  round 0.8 hole 0.6: 1(0,0)
Pad_e1075
  round 0.8 hole 0.6: 1(0,0)
Pad_e1076
  round 0.8 hole 0.6: 1(0,0)
Pad_e1077
  round 0.8 hole 0.6: 1(0,0)
Pad_e1078
  round 0.8 hole 0.6: 1(0,0)
Pad_e1079
  round 0.8 hole 0.6: 1(0,0)
Pad_e1080
  round 0.8 hole 0.6: 1(0,0)
Pad_e1081
  round 0.8 hole 0.6: 1(0,0)
Pad_e1082
  round 0.8 hole 0.6: 1(0,0)
Pad_e1083
  round 0.8 hole 0.6: 1(0,0)
Pad_e1084
  round 0.8 hole 0.6: 1(0,0)
Pad_e1085
  round 0.8 hole 0.6: 1(0,0)
Pad_e1086
  round 0.8 hole 0.6: 1(0,0)
Pad_e1087
  round 0.8 hole 0.6: 1(0,0)
Pad_e1088
  round 0.8 hole 0.6: 1(0,0)
Pad_e1089
  round 0.8 hole 0.6: 1(0,0)
Pad_e1090
  round 0.8 hole 0.6: 1(0,0)
Pad_e1091
  round 0.8 hole 0.6: 1(0,0)
Pad_e1092
  round 0.8 hole 0.6: 1(0,0)
Pad_e1093
  round 0.8 hole 0.6: 1(0,0)
Pad_e1094
  round 0.8 hole 0.6: 1(0,0)
Pad_e1095
  round 0.8 hole 0.6: 1(0,0)
Pad_e1096
  round 0.8 hole 0.6: 1(0,0)
Pad_e1097
  round 0.8 hole 0.6: 1(0,0)
Pad_e1098
  round 0.8 hole 0.6: 1(0,0)
Pad_e1099
  round 0.8 hole 0.6: 1(0,0)
Pad_e1100
  round 0.8 hole 0.6: 1(0,0)
Pad_e1101
  round 0.8 hole 0.6: 1(0,0)
Pad_e1102
  round 0.8 hole 0.6: 1(0,0)
Pad_e1103
  round 0.8 hole 0.6: 1(0,0)
Pad_e1104
  round 0.8 hole 0.6: 1(0,0)
Pad_e1105
  round 0.8 hole 0.6: 1(0,0)
Pad_e1106
  round 0.8 hole 0.6: 1(0,0)
Pad_e1107
  round 0.8 hole 0.6: 1(0,0)
Pad_e1108
  round 0.8 hole 0.6: 1(0,0)
Pad_e1109
  round 0.8 hole 0.6: 1(0,0)
Pad_e1110
  round 0.8 hole 0.6: 1(0,0)
Pad_e1111
  round 0.8 hole 0.6: 1(0,0)
Pad_e1112
  round 0.8 hole 0.6: 1(0,0)
Pad_e1113
  round 0.8 hole 0.6: 1(0,0)
Pad_e1114
  round 0.8 hole 0.6: 1(0,0)
Pad_e1115
  round 0.8 hole 0.6: 1(0,0)
Pad_e1116
  round 0.8 hole 0.6: 1(0,0)
Pad_e1117
  round 0.8 hole 0.6: 1(0,0)
Pad_e1118
  round 0.8 hole 0.6: 1(0,0)
Pad_e1119
  round 0.8 hole 0.6: 1(0,0)
Pad_e1120
  round 0.8 hole 0.6: 1(0,0)
Pad_e1121
  round 0.8 hole 0.6: 1(0,0)
Pad_e1122
  round 0.8 hole 0.6: 1(0,0)
Pad_e1123
  round 0.8 hole 0.6: 1(0,0)
Pad_e1124
  round 0.8 hole 0.6: 1(0,0)
Pad_e1125
  round 0.8 hole 0.6: 1(0,0)
Pad_e1126
  round 0.8 hole 0.6: 1(0,0)
Pad_e1127
  round 0.8 hole 0.6: 1(0,0)
Pad_e1128
  round 0.8 hole 0.6: 1(0,0)
Pad_e1129
  round 0.8 hole 0.6: 1(0,0)
Pad_e1130
  round 0.8 hole 0.6: 1(0,0)
Pad_e1131
  round 0.8 hole 0.6: 1(0,0)
Pad_e1132
  round 0.8 hole 0.6: 1(0,0)
Pad_e1133
  round 0.8 hole 0.6: 1(0,0)
Pad_e1134
  round 0.8 hole 0.6: 1(0,0)
Pad_e1135
  round 0.8 hole 0.6: 1(0,0)
Pad_e1136
  round 0.8 hole 0.6: 1(0,0)
Pad_e1137
  round 0.8 hole 0.6: 1(0,0)
Pad_e1138
  round 0.8 hole 0.6: 1(0,0)
Pad_e1139
  round 0.8 hole 0.6: 1(0,0)
Pad_e1140
  round 0.8 hole 0.6: 1(0,0)
Pad_e1142
  round 0.8 hole 0.6: 1(0,0)
Pad_e1143
  round 0.8 hole 0.6: 1(0,0)
Pad_e1144
  round 0.8 hole 0.6: 1(0,0)
Pad_e1145
  round 0.8 hole 0.6: 1(0,0)
Pad_e1146
  round 0.8 hole 0.6: 1(0,0)
Pad_e1147
  round 0.8 hole 0.6: 1(0,0)
Pad_e1148
  round 0.8 hole 0.6: 1(0,0)
Pad_e1149
  round 0.8 hole 0.6: 1(0,0)
Pad_e1150
  round 0.8 hole 0.6: 1(0,0)
Pad_e1151
  round 0.8 hole 0.6: 1(0,0)
Pad_e1152
  round 0.8 hole 0.6: 1(0,0)
Pad_e1153
  round 0.8 hole 0.6: 1(0,0)
Pad_e1154
  round 0.8 hole 0.6: 1(0,0)
Pad_e1155
  round 0.8 hole 0.6: 1(0,0)
Pad_e1156
  round 0.8 hole 0.6: 1(0,0)
Pad_e1157
  round 0.8 hole 0.6: 1(0,0)
Pad_e1158
  round 0.8 hole 0.6: 1(0,0)
Pad_e1159
  round 0.8 hole 0.6: 1(0,0)
Pad_e1160
  round 0.8 hole 0.6: 1(0,0)
Pad_e1161
  round 0.8 hole 0.6: 1(0,0)
Pad_e1162
  round 0.8 hole 0.6: 1(0,0)
Pad_e1163
  round 0.8 hole 0.6: 1(0,0)
Pad_e1164
  round 0.8 hole 0.6: 1(0,0)
Pad_e1165
  round 0.8 hole 0.6: 1(0,0)
Pad_e1166
  round 0.8 hole 0.6: 1(0,0)
Pad_e1167
  round 0.8 hole 0.6: 1(0,0)
Pad_e1168
  round 0.8 hole 0.6: 1(0,0)
Pad_e1169
  round 0.8 hole 0.6: 1(0,0)
Pad_e1170
  round 0.8 hole 0.6: 1(0,0)
Pad_e1171
  round 0.8 hole 0.6: 1(0,0)
Pad_e1172
  round 0.8 hole 0.6: 1(0,0)
Pad_e1173
  round 0.8 hole 0.6: 1(0,0)
Pad_e1174
  round 0.8 hole 0.6: 1(0,0)
Pad_e1175
  round 0.8 hole 0.6: 1(0,0)
Pad_e1176
  round 0.8 hole 0.6: 1(0,0)
Pad_e1177
  round 0.8 hole 0.6: 1(0,0)
Pad_e1178
  round 0.8 hole 0.6: 1(0,0)
Pad_e1179
  round 0.8 hole 0.6: 1(0,0)
Pad_e1180
  round 0.8 hole 0.6: 1(0,0)
Pad_e1181
  round 0.8 hole 0.6: 1(0,0)
Pad_e1182
  round 0.8 hole 0.6: 1(0,0)
Pad_e1183
  round 0.8 hole 0.6: 1(0,0)
Pad_e1184
  round 0.8 hole 0.6: 1(0,0)
Pad_e1185
  round 0.8 hole 0.6: 1(0,0)
Pad_e1186
  round 0.8 hole 0.6: 1(0,0)
Pad_e1187
  round 0.8 hole 0.6: 1(0,0)
Pad_e1188
  round 0.8 hole 0.6: 1(0,0)
Pad_e1189
  round 0.8 hole 0.6: 1(0,0)
Pad_e1190
  round 0.8 hole 0.6: 1(0,0)
Pad_e1191
  round 0.8 hole 0.6: 1(0,0)
Pad_e1192
  round 0.8 hole 0.6: 1(0,0)
Pad_e1193
  round 0.8 hole 0.6: 1(0,0)
Pad_e1194
  round 0.8 hole 0.6: 1(0,0)
Pad_e1195
  round 0.8 hole 0.6: 1(0,0)
Pad_e1196
  round 0.8 hole 0.6: 1(0,0)
Pad_e1197
  round 0.8 hole 0.6: 1(0,0)
Pad_e1198
  round 0.8 hole 0.6: 1(0,0)
Pad_e1199
  round 0.8 hole 0.6: 1(0,0)
Pad_e1200
  round 0.8 hole 0.6: 1(0,0)
Pad_e1201
  round 0.8 hole 0.6: 1(0,0)
Pad_e1202
  round 0.8 hole 0.6: 1(0,0)
Pad_e1203
  round 0.8 hole 0.6: 1(0,0)
Pad_e1204
  round 0.8 hole 0.6: 1(0,0)
Pad_e1205
  round 0.8 hole 0.6: 1(0,0)
Pad_e1206
  round 0.8 hole 0.6: 1(0,0)
Pad_e1207
  round 0.8 hole 0.6: 1(0,0)
Pad_e1208
  round 0.8 hole 0.6: 1(0,0)
Pad_e1209
  round 0.8 hole 0.6: 1(0,0)
Pad_e1210
  round 0.8 hole 0.6: 1(0,0)
Pad_e1211
  round 0.8 hole 0.6: 1(0,0)
Pad_e1212
  round 0.8 hole 0.6: 1(0,0)
Pad_e1213
  round 0.8 hole 0.6: 1(0,0)
Pad_e1214
  round 0.8 hole 0.6: 1(0,0)
Pad_e1215
  round 0.8 hole 0.6: 1(0,0)
Pad_e1216
  round 0.8 hole 0.6: 1(0,0)
Pad_e1217
  round 0.8 hole 0.6: 1(0,0)
Pad_e1218
  round 0.8 hole 0.6: 1(0,0)
Pad_e1219
  round 0.8 hole 0.6: 1(0,0)
Pad_e1220
  round 0.8 hole 0.6: 1(0,0)
Pad_e1221
  round 0.8 hole 0.6: 1(0,0)
Pad_e1222
  round 0.8 hole 0.6: 1(0,0)
Pad_e1223
  round 0.8 hole 0.6: 1(0,0)
R0805
  rect 1.133x1.377 smd: 1(-1,0) 2(1,0)
SMA-SMD_BWSMA-KE-P001
  rect 4.8x1.2 smd: 1(0,-2.55) 2(0,2.55) 5(0,0)
  rect 4.8x1.2 smd far side: 3(0,2.55) 4(0,-2.55)

## Nets
3V3: 3V3.1 NOREF#40.2 NOREF#159.1 OLED显示屏模块.2 R12.2 R13.2 SI5351.1 U3.15 U3.18 U4.2 U5.2
5V: 3V3.20 U3.14 U3.19 U5.1
+5V: +5V.1 C1.1 C3.2 NOREF#107.2 NOREF#162.2 R11.1 TM1637.4 串口屏.1
GND: 3V3.19 +5V.2 AD9959.1 AD9959.2 AD9959.3 AD9959.5 AD9959.7 AD9959.11 AD9959.13 AD9959.14 ADC1(PA27).1 ADC1(PA27).2 ADC1(PA27).3 ADC1(PA27).4 ADC2(PA15).1 ADC2(PA15).2 ADC2(PA15).3 ADC2(PA15).4 C1.2 C3.1 DAC8552.4 GND.1 KEY1.2 KEY1.4 KEY2.2 KEY2.4 LED1.2 NOREF.1 NOREF#2.1 NOREF#3.1 NOREF#4.1 NOREF#5.1 NOREF#6.1 NOREF#7.1 NOREF#8.1 NOREF#9.1 NOREF#10.1 NOREF#11.1 NOREF#12.1 NOREF#13.1 NOREF#14.1 NOREF#16.1 NOREF#17.1 NOREF#18.1 NOREF#19.1 NOREF#20.1 NOREF#21.1 NOREF#22.1 NOREF#23.1 NOREF#24.1 NOREF#25.1 NOREF#26.1 NOREF#27.1 NOREF#28.1 NOREF#29.1 NOREF#30.1 NOREF#31.1 NOREF#32.1 NOREF#33.1 NOREF#34.1 NOREF#35.1 NOREF#36.1 NOREF#37.1 NOREF#38.1 NOREF#39.1 NOREF#41.1 NOREF#42.1 NOREF#43.1 NOREF#44.1 NOREF#45.1 NOREF#46.1 NOREF#47.1 NOREF#49.1 NOREF#51.1 NOREF#52.1 NOREF#53.1 NOREF#54.1 NOREF#55.1 NOREF#56.1 NOREF#59.1 NOREF#60.1 NOREF#61.1 NOREF#62.1 NOREF#63.1 NOREF#64.1 NOREF#65.1 NOREF#66.1 NOREF#67.1 NOREF#68.1 NOREF#69.1 NOREF#70.1 NOREF#71.1 NOREF#72.1 NOREF#73.1 NOREF#74.1 NOREF#75.1 NOREF#76.1 NOREF#77.1 NOREF#78.1 NOREF#80.1 NOREF#81.1 NOREF#82.1 NOREF#83.1 NOREF#84.1 NOREF#85.1 NOREF#86.1 NOREF#87.1 NOREF#88.1 NOREF#89.1 NOREF#91.1 NOREF#93.1 NOREF#94.1 NOREF#95.1 NOREF#96.1 NOREF#97.1 NOREF#98.1 NOREF#100.1 NOREF#101.1 NOREF#102.1 NOREF#103.1 NOREF#104.1 NOREF#105.1 NOREF#106.1 NOREF#108.1 NOREF#109.1 NOREF#110.1 NOREF#111.1 NOREF#112.1 NOREF#113.1 NOREF#114.1 NOREF#115.1 NOREF#116.1 NOREF#117.1 NOREF#118.1 NOREF#119.1 NOREF#120.1 NOREF#121.1 NOREF#122.1 NOREF#123.1 NOREF#124.1 NOREF#125.1 NOREF#126.1 NOREF#127.1 NOREF#128.1 NOREF#129.1 NOREF#130.1 NOREF#131.1 NOREF#132.1 NOREF#133.1 NOREF#134.1 NOREF#135.1 NOREF#136.1 NOREF#137.1 NOREF#138.1 NOREF#139.1 NOREF#140.1 NOREF#142.1 NOREF#143.1 NOREF#144.1 NOREF#145.1 NOREF#146.1 NOREF#147.1 NOREF#148.1 NOREF#149.1 NOREF#150.1 NOREF#151.1 NOREF#152.1 NOREF#153.1 NOREF#154.1 NOREF#155.1 NOREF#156.1 NOREF#157.1 NOREF#158.1 NOREF#160.1 NOREF#161.1 NOREF#163.1 NOREF#164.1 NOREF#165.1 NOREF#166.1 NOREF#167.1 NOREF#168.1 NOREF#169.1 NOREF#170.1 NOREF#171.1 NOREF#172.1 NOREF#173.1 NOREF#174.1 NOREF#175.1 NOREF#176.1 NOREF#177.1 NOREF#178.1 NOREF#179.1 NOREF#180.1 NOREF#181.1 NOREF#182.1 NOREF#184.1 NOREF#186.1 NOREF#187.1 NOREF#188.1 NOREF#189.1 NOREF#190.1 NOREF#191.1 NOREF#193.1 NOREF#194.1 NOREF#195.1 NOREF#196.1 NOREF#197.1 NOREF#199.1 NOREF#200.1 NOREF#201.1 NOREF#202.1 NOREF#203.1 NOREF#204.1 NOREF#205.1 NOREF#206.1 NOREF#207.1 NOREF#208.1 NOREF#209.1 NOREF#210.1 NOREF#211.1 NOREF#212.1 NOREF#213.1 NOREF#214.1 NOREF#215.1 NOREF#216.1 NOREF#217.1 NOREF#218.1 NOREF#219.1 NOREF#220.1 NOREF#221.1 NOREF#223.1 NOREF#224.1 NOREF#225.1 NOREF#227.1 NOREF#228.1 NOREF#229.1 NOREF#230.1 NOREF#231.1 NOREF#232.1 NOREF#233.1 OLED显示屏模块.1 PE4302.1 SI5351.2 TIMA1(PA28).1 TIMA1(PA28).2 TIMA1(PA28).3 TIMA1(PA28).4 TIMG0(PA12).1 TIMG0(PA12).2 TIMG0(PA12).3 TIMG0(PA12).4 TM1637.3 U2.20 U3.16 U3.17 U3.21 U3.22 U4.1 串口屏.4
CLK_4302(PB26): NOREF#50.1 PE4302.3 U3.2
CLK_TM1637(PB11): TM1637.1 U3.29
CS_8688(PB19): 3V3.18 AD8688.3
CS_9959(PB6): AD9959.10 U2.13
DAISY_8688(PB13): AD8688.4 NOREF#90.1 NOREF#192.1 U2.6
DATA_4302(PB24): 3V3.6 PE4302.2
DIN_8552(PA12): DAC8552.1 NOREF#48.1 NOREF#92.1 U2.9
DIO_TM1637(PB22): TM1637.2 U3.30
LE_4302(PB27): NOREF#222.1 PE4302.4 U3.1
NRST: U2.16
PA0: GND.2 U3.32
PA1: GND.6 U3.27
PA2: U3.23
PA3: U3.10
PA4: U3.24
PA5: U3.9
PA6: U3.25
PA7: KEY2.1 NOREF#57.1 U3.8
PA8: 3V3.4 U5.4
PA10: GND.8 U3.13
PA11: GND.9 U3.20
PA12: TIMG0(PA12).5 U3.11
PA13: GND.7 U3.12
PA15: 3V3.11 ADC2(PA15).5
PA21: U3.7
PA22: 3V3.17 KEY1.1
PA23: U3.6
PA24: 3V3.14 U5.6
PA25: 3V3.2 U5.3
PA26: 3V3.5 U5.5
PA27: 3V3.8 ADC1(PA27).5 NOREF#99.1 NOREF#185.2 NOREF#226.1
PA28: TIMA1(PA28).5 U2.3
PA29: GND.10 U4.5
PA30: NOREF#15.1 NOREF#198.1 U4.4 U5.10
PA31: U2.4 U5.8
PB1: U2.2 U5.7
PB5: GND.5 U3.28
PB14: NOREF#141.1 NOREF#234.1 U4.3 U5.9
PB20: U2.5 继电器模块.1
PB21: GND.4 U3.4
PB23: U3.3 继电器模块.2
PB25: GND.3 U3.31
PDC_9959(PB12): AD9959.4 NOREF#183.1 U2.19
RST_8688(PB4): AD8688.5 U2.1
RST_9959(PB0): AD9959.6 U2.12
RX1(PA10): U2.7 串口屏.3
RX(PA17): 3V3.13 串口2.2
SCK_9959(PB8): AD9959.12 U2.15
SCL_5351(PB17): SI5351.4 U2.18
SCL_OLED(PB2): 3V3.9 OLED显示屏模块.3
SCLK_8552(PA13): DAC8552.2 NOREF#58.1 NOREF#79.1 U2.10
SCLK_8688(PB10): AD8688.2 U3.5
SD0_9959(PB16): AD9959.9 U2.11
SDA_5351(PB18): 3V3.16 SI5351.3
SDA_OLED(PB3): 3V3.10 OLED显示屏模块.4
SDC_8688(PB15): AD8688.1 U2.17
SDI_8688(PB9): 3V3.7 AD8688.6
SW1: 3V3.3
SW2: 3V3.12
SYNC_8552(PA14): DAC8552.3 U3.26
TX1(PA11): U2.8 串口屏.2
TX(PA18): 3V3.15 串口2.1
UP_9959(PB7): AD9959.8 U2.14
$1N1385: LED1.1 R11.2
$1N2419: KEY1.3 R12.1
$1N2433: KEY2.3 R13.1

## Via types
v1: diameter 0.61, hole 0.5, Top Layer to Bottom Layer, 4 vias
v2: diameter 0.61, hole 0.305, Top Layer to Bottom Layer, 15 vias
v3: diameter 0.8, hole 0.6, Top Layer to Bottom Layer, 1 via

## Routing (per net, layer and track width the routed paths; a pad name or vN(x,y) marks a point on that pad's centre or on a via; arc(x,y) is an arc through that point)
3V3: length 213.4
  Top Layer w0.254: R12.2 NOREF#159.1
  Top Layer w0.4: SI5351.1 77.98,8.62 77.98,30.91 76.96,31.93 ; 76.96,31.93 77.22,32.18 77.22,32.94 74.69,35.47 R13.2 ; 76.96,31.93 76.65,31.61 70.43,31.61 R12.2
  Top Layer w0.6: NOREF#40.2 23.88,88.32 23.88,92.63 26.42,95.17 3V3.1 ; v3(15.75,46.91) 15.75,37.77 22.1,31.42 26.67,31.42 29.21,28.88 46.99,28.88 OLED显示屏模块.2
  Top Layer w0.8: 3V3.1 27.13,95.63 28.45,96.95 31.97,96.95 U5.2
  Bottom Layer w0.6: v3(15.75,46.91) 15.75,80.19 NOREF#40.2 ; NOREF#159.1 42.93,28.88 46.99,28.88 OLED显示屏模块.2
5V: length 12
  Top Layer w0.8: 3V3.20 31.2,95.17 U5.1
+5V: length 173.7
  Top Layer w0.8: R11.1 C3.2 12.45,96.43 +5V.1 13.23,95.08 ; 13.23,95.08 18.96,95.08 22.61,98.73 88.08,98.73 串口屏.1 ; 13.23,95.08 NOREF#107.2 ; TM1637.4 25.91,30.4 21.59,30.4 13.23,38.77 NOREF#162.2
  Bottom Layer w0.8: NOREF#107.2 NOREF#162.2
CLK_4302(PB26): length 71.7
  Top Layer w0.254: NOREF#50.1 81.77,36.5 PE4302.3
  Bottom Layer w0.254: U3.2 37.34,41.75 NOREF#50.1
CLK_TM1637(PB11): length 33.2
  Bottom Layer w0.254: TM1637.1 32.51,37.52 32.51,44.88 33.27,45.64 41.15,45.64 42.35,44.44 U3.29
CS_8688(PB19): length 115.4
  Top Layer w0.254: 3V3.18 32.77,87 32.77,41.07 34.82,39.02 AD8688.3
CS_9959(PB6): length 36.9
  Top Layer w0.254: AD9959.10 95.25,59.61 83.82,59.61 71.63,71.81 71.63,76.63 72.39,77.39 U2.13
DAISY_8688(PB13): length 66.6
  Top Layer w0.254: NOREF#90.1 83.57,83.74 NOREF#192.1
  Bottom Layer w0.254: NOREF#192.1 71.6,83.74 U2.6 ; NOREF#90.1 88.65,44.9 AD8688.4
DATA_4302(PB24): length 128.3
  Top Layer w0.254: 3V3.6 27.13,82.43 24.41,79.7 24.41,48.17 34.4,38.18 34.65,38.18 34.8,38.02 88.39,38.02 99.06,27.36 99.06,20.26 PE4302.2
DIN_8552(PA12): length 113.3
  Top Layer w0.254: NOREF#48.1 NOREF#92.1
  Bottom Layer w0.254: NOREF#92.1 69.57,75.62 U2.9 ; NOREF#48.1 34.54,78.16 33.78,78.16 30.75,75.12 30.75,74.41 30.12,73.78 29.4,73.78 28.21,72.58 28.21,71.87 26.01,69.67 26.01,52.84 3.72,30.55 3.72,17.3 DAC8552.1
DIO_TM1637(PB22): length 26.9
  Bottom Layer w0.254: TM1637.2 33.02,35.48 33.02,42.6 33.53,43.1 38.61,43.1 39.81,44.31 U3.30
LE_4302(PB27): length 73.1
  Top Layer w0.254: PE4302.4 83.51,37.26 NOREF#222.1
  Bottom Layer w0.254: U3.1 34.54,41.63 NOREF#222.1
PA0: length 13.1
  Top Layer w0.254: GND.2 34.73,48.41 U3.32
PA1: length 12
  Top Layer w0.254: U3.27 47.43,50.95 GND.6
PA7: length 26.6
  Top Layer w0.254: KEY2.1 NOREF#57.1
  Bottom Layer w0.254: U3.8 52.51,40.38 53.59,39.29 68.58,39.29 NOREF#57.1
PA8: length 20.4
  Top Layer w0.254: U5.4 44.41,86.03 v1(33.53,86.03)
  Bottom Layer w0.254: 3V3.4 28.4,86.28 29.97,86.28 30.22,86.03 v1(33.53,86.03)
PA10: length 17
  Top Layer w0.254: GND.8 64.01,47.13 64.01,42.34 64.54,41.81 U3.13
PA11: length 13.1
  Top Layer w0.254: U3.20 65.21,46.47 58.93,52.76 58.93,54.75 GND.9
PA12: length 67.2
  Top Layer w0.254: TIMG0(PA12).5 19.3,60.38 v2(22.1,57.58) ; v2(25.07,56.06) 31.67,49.45 v2(31.67,47.17)
  Bottom Layer w0.254: v2(31.67,47.17) 57.15,47.17 58.93,45.39 58.93,43.02 U3.11 ; v2(22.1,57.58) 23.62,56.06 v2(25.07,56.06)
PA13: length 17
  Top Layer w0.254: GND.7 61.47,47.13 61.47,42.34 62,41.81 U3.12
PA15: length 27.2
  Top Layer w0.254: ADC2(PA15).5 v1(22.1,72.82) ; v2(24.99,72.82) 25.91,72.82 26.67,73.58 28.4,73.58 3V3.11
  Bottom Layer w0.254: v1(22.1,72.82) v2(24.99,72.82)
PA22: length 96.1
  Top Layer w0.254: KEY1.1 37.34,33.2 23.11,47.42 23.11,86.03 25.84,88.76 28.46,88.76 3V3.17
PA24: length 24.9
  Top Layer w0.254: v1(34.44,79.93) 43.4,79.93 U5.6
  Bottom Layer w0.254: v1(34.44,79.93) 3V3.14
PA25: length 19.6
  Top Layer w0.254: U5.3 42.38,86.54 37.08,86.54 32.26,91.36 28.45,91.36 27.18,92.63 3V3.2
PA26: length 24.1
  Top Layer w0.254: U5.5 44.67,83.74 v1(33.53,83.74)
  Bottom Layer w0.254: v1(33.53,83.74) 27.94,83.74 27.13,84.55 3V3.5
PA27: length 30.1
  Top Layer w0.254: NOREF#99.1 NOREF#185.2 ; NOREF#226.1 ADC1(PA27).5
  Bottom Layer w0.254: NOREF#226.1 19.81,85.01 NOREF#185.2 ; NOREF#99.1 26.37,76.63 3V3.8
PA28: length 105.6
  Top Layer w0.254: U2.3 69.09,90.09 v2(67.82,91.36) ; v2(20.07,57.84) 20.07,50.47 17.53,47.93 TIMA1(PA28).5
  Bottom Layer w0.254: v2(20.07,57.84) 20.07,76.12 25.65,81.71 25.65,90.35 26.67,91.36 v2(67.82,91.36)
PA29: length 21.9
  Top Layer w0.254: GND.10 61.43,50.76 65.53,46.66 75.47,46.66 U4.5
PA30: length 50.1
  Top Layer w0.254: NOREF#198.1 64.52,56.06 64.52,52.76 66.55,50.72 U4.4 ; NOREF#15.1 65.02,84.21 U5.10
  Bottom Layer w0.254: NOREF#15.1 NOREF#198.1
PA31: length 15.6
  Top Layer w0.254: U5.8 56.39,87.81 58.17,89.59 68.3,89.59 U2.4
PB1: length 18.5
  Top Layer w0.254: U5.7 58.64,92.63 U2.2
PB5: length 12
  Top Layer w0.254: U3.28 44.89,50.95 GND.5
PB14: length 47.7
  Top Layer w0.254: U4.3 67.31,53.26 NOREF#234.1 ; NOREF#141.1 64.01,82.69 U5.9
  Bottom Layer w0.254: NOREF#141.1 64.01,56.57 NOREF#234.1
PB20: length 103.4
  Top Layer w0.254: U2.5 69.85,85.01 69.09,84.25 69.09,73.08 64.01,68 v2(64.01,49.2)
  Bottom Layer w0.254: 继电器模块.1 71.35,19.46 81.03,29.13 81.03,35.99 76.71,40.31 64.52,40.31 64.01,40.82 v2(64.01,49.2)
PB21: length 15.7
  Top Layer w0.254: U3.4 42.18,41.81 41.15,42.85 41.15,49.75 GND.4
PB23: length 52.2
  Bottom Layer w0.254: 继电器模块.2 68.85,14.64 45.21,38.28 43.35,38.28 U3.3
PB25: length 13.1
  Top Layer w0.254: GND.3 37.27,48.41 U3.31
PDC_9959(PB12): length 49
  Bottom Layer w0.254: U2.19 96.52,92.63 98.04,91.11 98.04,70.03 AD9959.4
RST_8688(PB4): length 81.8
  Top Layer w0.254: AD8688.5 97.03,34.49 98.86,36.32 98.86,78.36 80.77,96.44 71.37,96.44 70.33,95.4 U2.1
RST_9959(PB0): length 27.9
  Top Layer w0.254: U2.12 72.87,73.87 79.5,67.23 95.25,67.23 AD9959.6
RX1(PA10): length 35
  Bottom Layer w0.254: 串口屏.3 97.54,86.81 97.54,88.57 96.77,89.33 96.03,89.33 87.9,81.2 71.6,81.2 U2.7
RX(PA17): length 60
  Bottom Layer w0.254: 串口2.2 25.65,52.99 25.65,74.9 26.87,76.12 28.96,76.12 29.67,76.84 3V3.13
SCK_9959(PB8): length 43.7
  Top Layer w0.254: U2.15 72.97,82.37 75.79,82.37 85.19,72.97 96.26,72.97 98.15,71.09 98.15,64.55 97.74,64.14 97.74,60.74 97.7,60.7 97.7,60.4 96.11,58.81 96.11,58.75 AD9959.12
SCL_5351(PB17): length 103.3
  Bottom Layer w0.254: U2.18 71.6,91.36 69.09,91.36 67.31,89.59 67.31,51.99 91.13,28.18 SI5351.4
SCL_OLED(PB2): length 73
  Top Layer w0.254: v2(30.23,45.64) v2(30.23,49.71) ; OLED显示屏模块.3 48.26,30.15 29.46,30.15 27.18,32.44 v2(27.18,40.06) ; v2(30.23,66.22) 30.99,66.98 30.99,72.82 30.23,73.58 28.96,73.58 27.69,74.85 3V3.9
  Bottom Layer w0.254: v2(30.23,45.64) 30.23,43.1 v2(27.18,40.06) ; v2(30.23,49.71) v2(30.23,66.22)
SCLK_8552(PA13): length 114.1
  Top Layer w0.254: NOREF#58.1 NOREF#79.1
  Bottom Layer w0.254: DAC8552.2 2.54,14.16 4.08,15.7 4.08,30.4 26.37,52.69 26.37,67.48 30.75,71.87 30.75,73.9 31.1,74.26 31.1,74.72 32.26,75.87 35.31,75.87 NOREF#58.1 ; NOREF#79.1 69.85,72.31 U2.10
SCLK_8688(PB10): length 54.4
  Top Layer w0.254: U3.5 44.89,40.89 46.23,39.55 95.06,39.55 AD8688.2
SD0_9959(PB16): length 25.8
  Top Layer w0.254: AD9959.9 84.33,60.88 72.9,72.31 U2.11
SDA_5351(PB18): length 128.8
  Bottom Layer w0.254: SI5351.3 88.63,30.17 66.95,51.84 66.95,85.27 66.77,85.45 30.1,85.45 3V3.16
SDA_OLED(PB3): length 68.9
  Top Layer w0.254: 3V3.10 27.13,67.28 v2(28.19,66.22) ; v2(28.19,45.64) v2(28.19,51.74) ; v2(27.18,42.09) 28.19,41.07 28.19,32.69 29.97,30.91 50.04,30.91 OLED显示屏模块.4
  Bottom Layer w0.254: v2(27.18,42.09) 27.18,44.63 v2(28.19,45.64) ; v2(28.19,51.74) v2(28.19,66.22)
SDC_8688(PB15): length 60.2
  Top Layer w0.254: U2.17 86.84,73.58 96.15,73.58 98.5,71.23 98.5,56.12 97.03,54.64 AD8688.1
SDI_8688(PB9): length 111.1
  Top Layer w0.254: 3V3.7 28.4,78.66 30.48,78.66 32.26,76.89 32.26,40.82 34.54,38.53 90.02,38.53 AD8688.6
SYNC_8552(PA14): length 72.9
  Bottom Layer w0.254: DAC8552.3 4.57,13.15 4.57,30.15 20.83,46.41 47.92,46.41 U3.26
TX1(PA11): length 30.5
  Bottom Layer w0.254: 串口屏.2 86.89,78.66 71.37,78.66 70.33,77.62 U2.8
TX(PA18): length 68.9
  Bottom Layer w0.254: 串口2.1 1.02,28.9 1.02,30.91 21.08,50.98 21.08,75.62 26.67,81.2 28.96,81.2 29.67,81.92 3V3.15
UP_9959(PB7): length 37
  Top Layer w0.254: U2.14 72.87,79.45 74.17,78.16 74.17,75.11 79.5,69.77 94.74,69.77 95.34,69.17 95.34,68.02 96.03,67.33 97.19,67.33 97.79,66.73 97.79,64.69 AD9959.8
$1N1385: length 2.1
  Top Layer w0.254: R11.2 5.44,94.43 LED1.1
$1N2419: length 3.9
  Top Layer w0.254: KEY1.3 69.26,35.48 R12.1
$1N2433: length 3.9
  Top Layer w0.254: KEY2.3 77.39,35.48 R13.1

## Copper pours and planes (outline as drawn; the poured copper is in the pictures)
3V3 on Top Layer: 76.06,33.96 78.23,33.96 78.23,29.9 76.06,29.9
+5V on Top Layer: 6.35,98.48 14.48,98.48 14.48,89.23 6.35,89.23
GND on Top Layer: -2.29,102.79 103.89,102.79 103.89,-3.38 -2.29,-3.38
GND on Bottom Layer: -2.29,103.05 103.63,103.05 103.63,-3.12 -2.29,-3.12

## Text on the board
Bottom Silkscreen Layer: 5V | 3V3 | PA0 | PA25 | PB25 | PA8 | PB21 | PA26 | PB5 | PA24 | PA1 | PB1 | PA13 | PA31 | PA10 | PB14 | PA11 | PA30 | PA29
Top Silkscreen Layer: PA25 | SW1 | PA8 | PA26 | PB24 | PB9 | PA27 | PB2 | PB3 | 5V | GND | PB19 | PA22 | PB18 | PA18 | PA24 | PA17 | SW2 | PA15 | PA12 | PB4 | PB1 | PA28 | PA31 | PB20 | PB13 | PA10 | PA11 | PA13 | PB0 | PB12 | PB17 | PB15 | NRST | PB8 | PB7 | PB6 | PB16 | PA0 | PB27 | PB25 | PB26 | PB22 | PB23 | PB11 | PB21 | PB5 | PB10 | PA1 | PA23 | PA14 | PA21 | PA6 | PA7 | PA4 | PA5 | PA2 | 3V3 | PB14 | PA30 | PA29 | PA3 | SDA | SCL | DIN | SCLK | SYNC | RX | TX | SD0 | SCK | RST | PDC | CS | UP | DAISY | DATA | CLK | SDC | LE | SDI | DIO | +5V | 2025TI杯_M0G3507拓展板_pjh_smy_lzn
